# EAGLE design oledrgb (EAGLE 7.2.0)
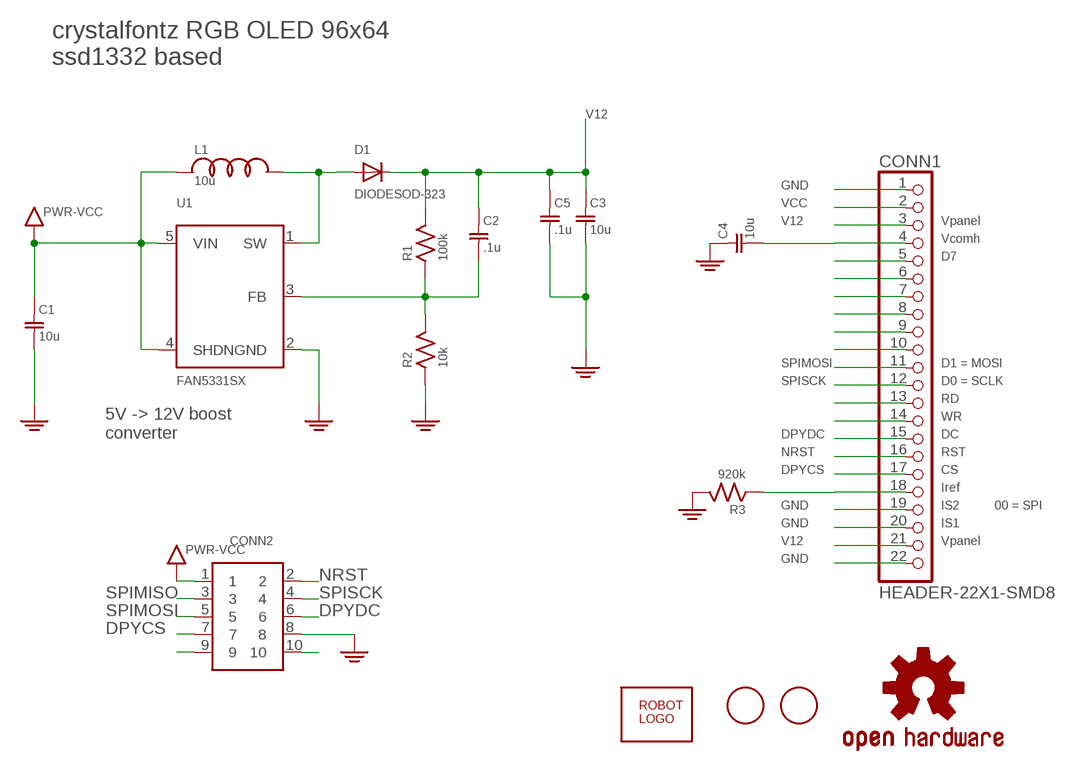
[diagram p0: schematic, sheet 1]

## Parts
C1  10u  C0603  [SMD0603]
C2  .1u  C0603  [SMD0603]
C3  10u  C0603  [SMD0603]
C4  10u  C0603  [SMD0603]
C5  .1u  C0603  [SMD0603]
CONN1  HEADER-22X1-SMD8  [HEADER-22X1-SMD8]
CONN2  HEADER-5X2-PTH  [HEADER-5X2-PTH]
D1  DIODESOD-323  [SOD-323]
L1  10u  LSMD0603  [SMD0603]
LOGO1  OSHW-LOGOS  [OSHW-LOGO-S]
R1  100k  R0603  [SMD0603]
R2  10k  R0603  [SMD0603]
R3  920k  R0603  [SMD0603]
U1  FAN5331SX  FAN5331  [SOT23-5]
U$1  ROBOTMAN-LOGO2  [ROBOTMAN-LOGO2]
U$2  FIDUCIAL  [FIDUCIAL_1MM]
U$3  FIDUCIAL  [FIDUCIAL_1MM]

## Nets
DPYCS: CONN1.17 CONN2.7
DPYDC: CONN1.15 CONN2.6
GND: C1.2 C3.2 C4.1 C5.2 CONN1.1 CONN1.19 CONN1.20 CONN1.22 CONN2.8 R2.1 R3.2 U1.2(GND) ; supply symbol labelled PWR-GND
N$1: D1.A L1.2 U1.1(SW)
N$3: C2.2 R1.1 R2.2 U1.3(FB)
N$4: CONN2.9
N$6: C4.2 CONN1.4
N$7: CONN1.5
N$8: CONN1.6
N$9: CONN1.7
N$10: CONN1.8
N$11: CONN1.9
N$12: CONN1.10
N$15: CONN1.13
N$16: CONN1.14
N$19: CONN2.10
N$20: CONN1.18 R3.1
NRST: CONN1.16 CONN2.2
SPIMISO: CONN2.3
SPIMOSI: CONN1.11 CONN2.5
SPISCK: CONN1.12 CONN2.4
V12: C2.1 C3.1 C5.1 CONN1.3 CONN1.21 D1.C R1.2
VCC: C1.1 CONN1.2 CONN2.1 L1.1 U1.4(SHDN) U1.5(VIN) ; supply symbol labelled PWR-VCC

## Notes on the sheet
- crystalfontz RGB OLED 96x64
  ssd1332 based
- Vpanel
- Vcomh
- D7
- D1 = MOSI
- D0 = SCLK
- RD
- WR
- 5V -> 12V boost
  converter
- DC
- RST
- CS
- Iref
- IS2 | 00 = SPI
- IS1
- Vpanel

## Library data of the parts
C1-C5 = jaw:C
CONN1 = jaw:HEADER-22X1
CONN2 = jaw:HEADER-5X2
D1 = jaw:DIODE
L1 = jaw:L
LOGO1 = Sparkfun-Aesthetics:OSHW-LOGO: Open Source Hardware Logo This logo indicates the piece of hardware it is found on incorporates a OSHW license and/or adheres to the definition of open source hardware found here: http://freedomdefined.org/OSHW
R1-R3 = jaw:R
U1 = microbuilder:FAN5331: FAN5331 - LED/OLED 20V Boost Converter Digikey: FAN5331SXCT-ND
U$1 = jaw:ROBOTMAN-LOGO
U$2 U$3 = adafruit:FIDUCIAL: For use by pick and place machines to calibrate the vision/machine, 1mm By microbuilder.eu

## Board
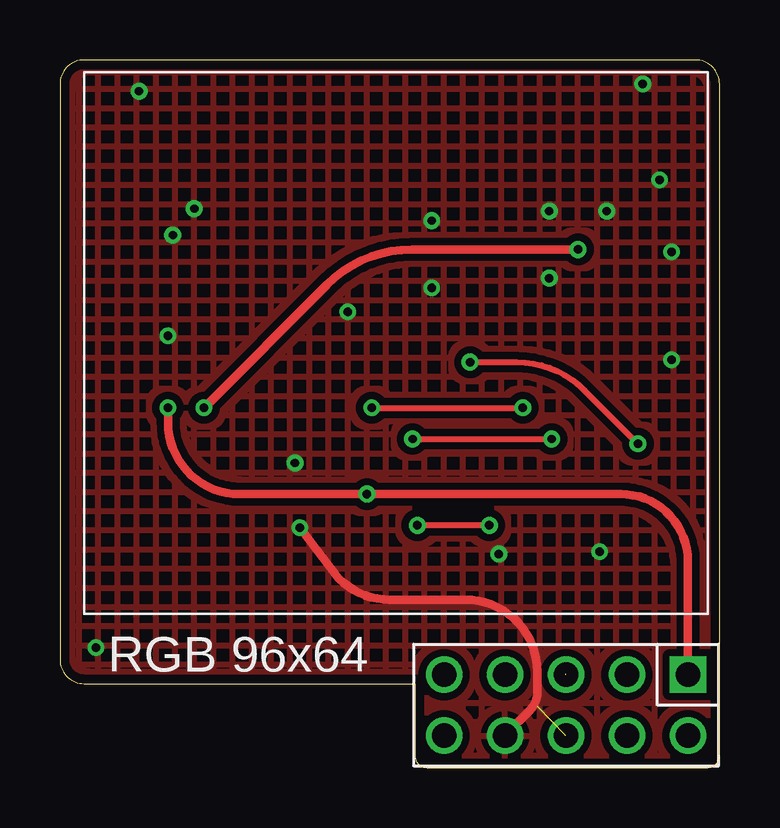
[diagram p1: board, top side]
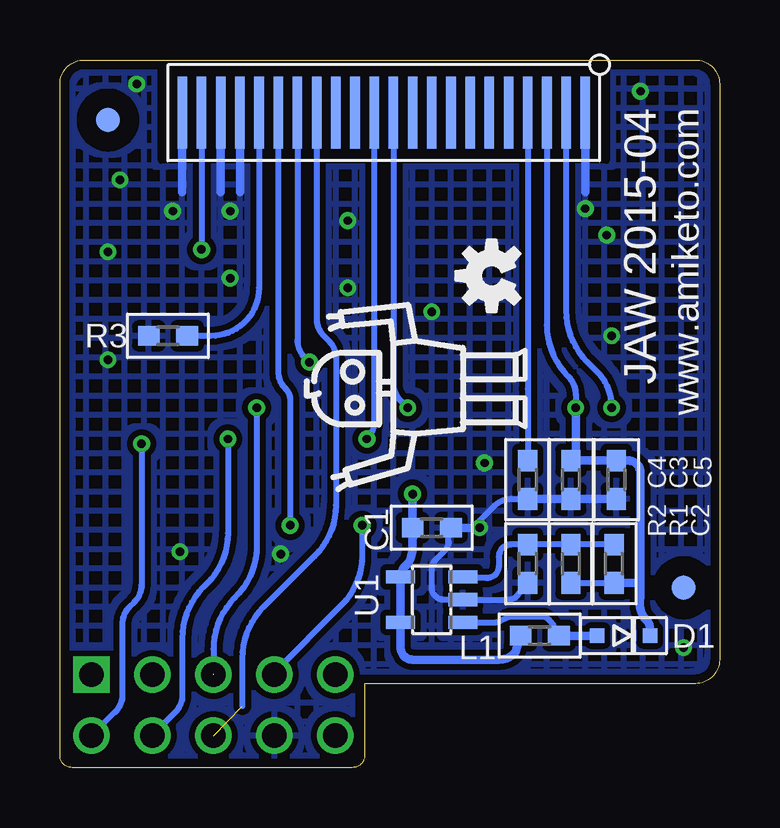
[diagram p2: board, bottom side, seen from below]

Size 27.5 x 29.5 mm. Coordinates in mm from the lower left corner, seen from the top.
Outline: 14.8,3.5 14.8,0.5 arc90 15.3,0 27,0 arc90 27.5,0.5 27.5,28.5 arc90 26.5,29.5 1,29.5 arc90 0,28.5 0,4.5 arc90 1,3.5 14.8,3.5
Copper layers (1*16): Top 0.0356mm / dielectric 1.5011mm / Bottom 0.0356mm
Design rules "LaenPCBOrder *": minimum track width 6mil, minimum drill 13mil, track to track 6mil, track to pad 6mil, pad to pad 6mil, via to via 6mil, smd to smd 6mil, copper to edge 15mil, drill to drill 6mil, minimum pad ring 7mil, minimum via ring 7mil, stop-mask expansion 4mil, vias tented up to drill 0.5mm, thermal gap 10mil

### Footprints (pad centres in the part's own frame; a part is rotated, then mirrored left to right if it is on the bottom)
SMD0603 = smd 0.9 x 0.8: 1 -0.8,0; 2 0.8,0
HEADER-22X1-SMD8 = smd 0.4 x 3: 1 -8.4,0.2; 2 -7.6,0.2; 3 -6.8,0.2; 4 -6,0.2; 5 -5.2,0.2; 6 -4.4,0.2; 7 -3.6,0.2; 8 -2.8,0.2; 9 -2,0.2; 10 -1.2,0.2; 11 -0.4,0.2; 12 0.4,0.2; 13 1.2,0.2; 14 2,0.2; 15 2.8,0.2; 16 3.6,0.2; 17 4.4,0.2; 18 5.2,0.2; 19 6,0.2; 20 6.8,0.2; 21 7.6,0.2; 22 8.4,0.2
HEADER-5X2-PTH = drill 1.016 square: 1 -5.08,-1.27 | drill 1.016: 2 -5.08,1.27; 3 -2.54,-1.27; 4 -2.54,1.27; 5 0,-1.27; 6 0,1.27; 7 2.54,-1.27; 8 2.54,1.27; 9 5.08,-1.27; 10 5.08,1.27
SOD-323 = smd 0.6 x 0.6: A 1.1,0; C -1.1,0
SOT23-5 = smd 0.55 x 1.2: 1 -0.95,-1.3; 2 0,-1.3; 3 0.95,-1.3; 4 0.95,1.3; 5 -0.95,1.3
FIDUCIAL_1MM = smd 1 x 1: 1 0,0

### Placement (x,y rotation side)
C1  12,10 0 bottom
C2  4.4,8.5 90 bottom
C3  6.2,12 270 bottom
C4  8,12 90 bottom
C5  4.3,12 270 bottom
CONN1  14,27.5 180 bottom
CONN2  21.1,2.6 180 top
D1  4,5.5 180 bottom
L1  7.5,5.5 0 bottom
LOGO1  9.5,20.5 90 bottom
R1  6.2,8.5 270 bottom
R2  8,8.5 90 bottom
R3  23,18 180 bottom
U1  12,7 90 bottom
U$1  12.5,15.8 90 bottom
U$2  1.5,7.5 0 bottom
U$3  25.5,27 0 bottom

### Tracks (layer width: path | path; a pad name or v marks a point on that pad's centre or on a via)
DPYCS  (via drill 0.35)
  Top 0.25: v17.9,10.1 v14.9,10.1
  Bottom 0.25: CONN1.17 18.4,16.51 arc-45 18.11,15.81 arc45 17.9,15.31 17.9,10.7 v17.9,10.1 | v14.9,10.1 14.9,8.88 arc44 15.75,6.79 18.56,3.98 CONN2.7
DPYDC  (1 unrouted)
  Bottom 0.25: CONN1.15 16.8,18.71 arc-45 16.51,18.01 16.29,17.79 arc45 16,17.09 16,10.94 arc45 16.88,8.82 19.02,6.68 arc-45 19.9,4.56 19.9,2.56
GND  (via drill 0.35)
  Top 0.35: 18.6,1.4 19.61,2.41 arc45 19.9,3.11 19.9,4 arc90 16.9,7 13.74,7 arc-45 11.62,7.88 v10,10
  Bottom 0.25: R2.1 8.45,7.15 arc45 8.81,7 U1.2 11.49,7 arc45 11.85,7.15 11.85,7.15 arc45 12,7.51 12,8.29 arc45 11.85,8.65 11.45,9.05 arc-45 11.3,9.41 11.3,9.9 C1.2 | v10,10 10,10.3 9.39,10.91 arc45 8.69,11.2 C4.1
  Bottom 0.35: CONN1.1 5.6,24 | CONN1.22 22.4,24 | CONN1.19 20,24 | CONN1.20 20.8,24 | 7.99,11.2 C4.1 7.99,11.2 | 7.99,11.2 C3.2 C5.2 | v10,10 C1.2
  other vias: 15.5,20 9.8,12.7 25.5,21.5 4.7,22.2 1.5,5 25.5,17 18.3,8.9 4.5,18 24.3,28.5 3.3,28.2 12,19 15.5,22.8 20.4,20.4 25,24.5 22.5,9 5.6,23.3 20.4,23.2 22.8,23.2
  pour Bottom (isolate 0.25, hatched): -1.6,29.9 -1.6,0 28,0 28,29.9
  pour Top (isolate 0.3, hatched): -1.6,29.9 -1.6,0 28,0 28,29.9
N$1
  Bottom 0.25: U1.1 9.37,6.05 arc-27 9.14,6.1 8.87,6.25 arc27 8.64,6.3 7.31,6.3 arc45 6.85,5.75 6.85,5.75 arc45 6.7,5.39 L1.2
  Bottom 0.35: D1.A L1.2
N$2
  cutout Bottom: 4.7,29.3 4.7,25.3 23.3,25.3 23.3,29.3
N$3
  Bottom 0.25: C2.2 R1.1 R2.2 8.7,9.3 arc-90 9.2,8.8 9.2,8.4 arc90 9.7,7.9 10.65,7.9 U1.3
N$6
  Bottom 0.25: CONN1.4 8,17.1 8,15.8 C4.2
N$20
  Bottom 0.25: CONN1.18 19.2,20 arc90 21.2,18 R3.1
NRST  (via drill 0.35)
  Top 0.25: v17.1,16.9 19.04,16.9 arc-45 21.87,15.73 v24.1,13.5
  Bottom 0.25: CONN2.2 25.19,2.32 arc-45 24.9,3.02 24.9,5.99 arc45 24.61,6.69 24.39,6.91 arc-45 24.1,7.61 v24.1,13.5 | CONN1.16 17.6,17.81 arc-45 17.31,17.11 v17.1,16.9
SPIMOSI  (via drill 0.35)  (1 unrouted)
  Top 0.25: v13,15 v19.3,15
  Bottom 0.25: CONN1.11 13.6,16.01 arc-45 13.31,15.31 v13,15 | v19.3,15 19.3,9.23 arc45 20.18,7.11 20.22,7.07 arc-45 21.1,4.95 21.1,3.9
SPISCK  (via drill 0.35)
  Top 0.25: v14.7,13.7 v20.5,13.7
  Bottom 0.25: CONN1.12 14.4,14.41 arc45 v14.69,13.71 v14.7,13.7 | v20.5,13.7 20.5,9.78 arc45 21.38,7.66 21.52,7.52 arc-45 22.4,5.39 22.4,3.01 arc45 22.69,2.31 23.64,1.36 CONN2.4
V12  (via drill 0.35)
  Top 0.35: v21.6,21.6 14.67,21.6 arc45 11.14,20.14 v6,15
  Bottom 0.25: R1.2 C2.1 | CONN1.3 7.2,18.44 arc-45 6.32,16.32 arc45 6,15.55 v6,15 | CONN1.21 v21.6,21.6
  Bottom 0.35: 6,12.8 C5.1 3.8,12.8 arc90 3.3,12.3 3.3,7.7 | 6,12.8 C3.1 | v6,15 6,12.8 | C2.1 3.3,7.7 | D1.C 2.9,5.79 arc-45 3.05,6.15 3.15,6.25 arc45 3.3,7.11 3.3,7.7
VCC  (via drill 0.35)
  Top 0.35: v4.5,15 4.5,14.4 arc90 7.5,11.4 v12.8,11.4 23.38,11.4 arc-90 26.18,8.6 26.18,8.5 CONN2.1
  Bottom 0.25: 12.7,9.6 C1.1 | CONN1.2 6.4,19.04 arc-45 5.52,16.92 5.14,16.54 arc45 v4.5,15
  Bottom 0.35: v12.8,11.4 C1.1 12.8,9.11 arc45 13.09,8.41 arc-45 13.3,7.91 13.3,7.45 U1.4 U1.5 13.3,5 arc-90 12.8,4.5 9.21,4.5 arc-45 8.51,4.79 L1.1

### Text on the board
tPlace: RGB 96x64
bPlace: www.amiketo.com | JAW 2015-04